# EAGLE design d701-vs1053-synth (EAGLE 7.5.0)
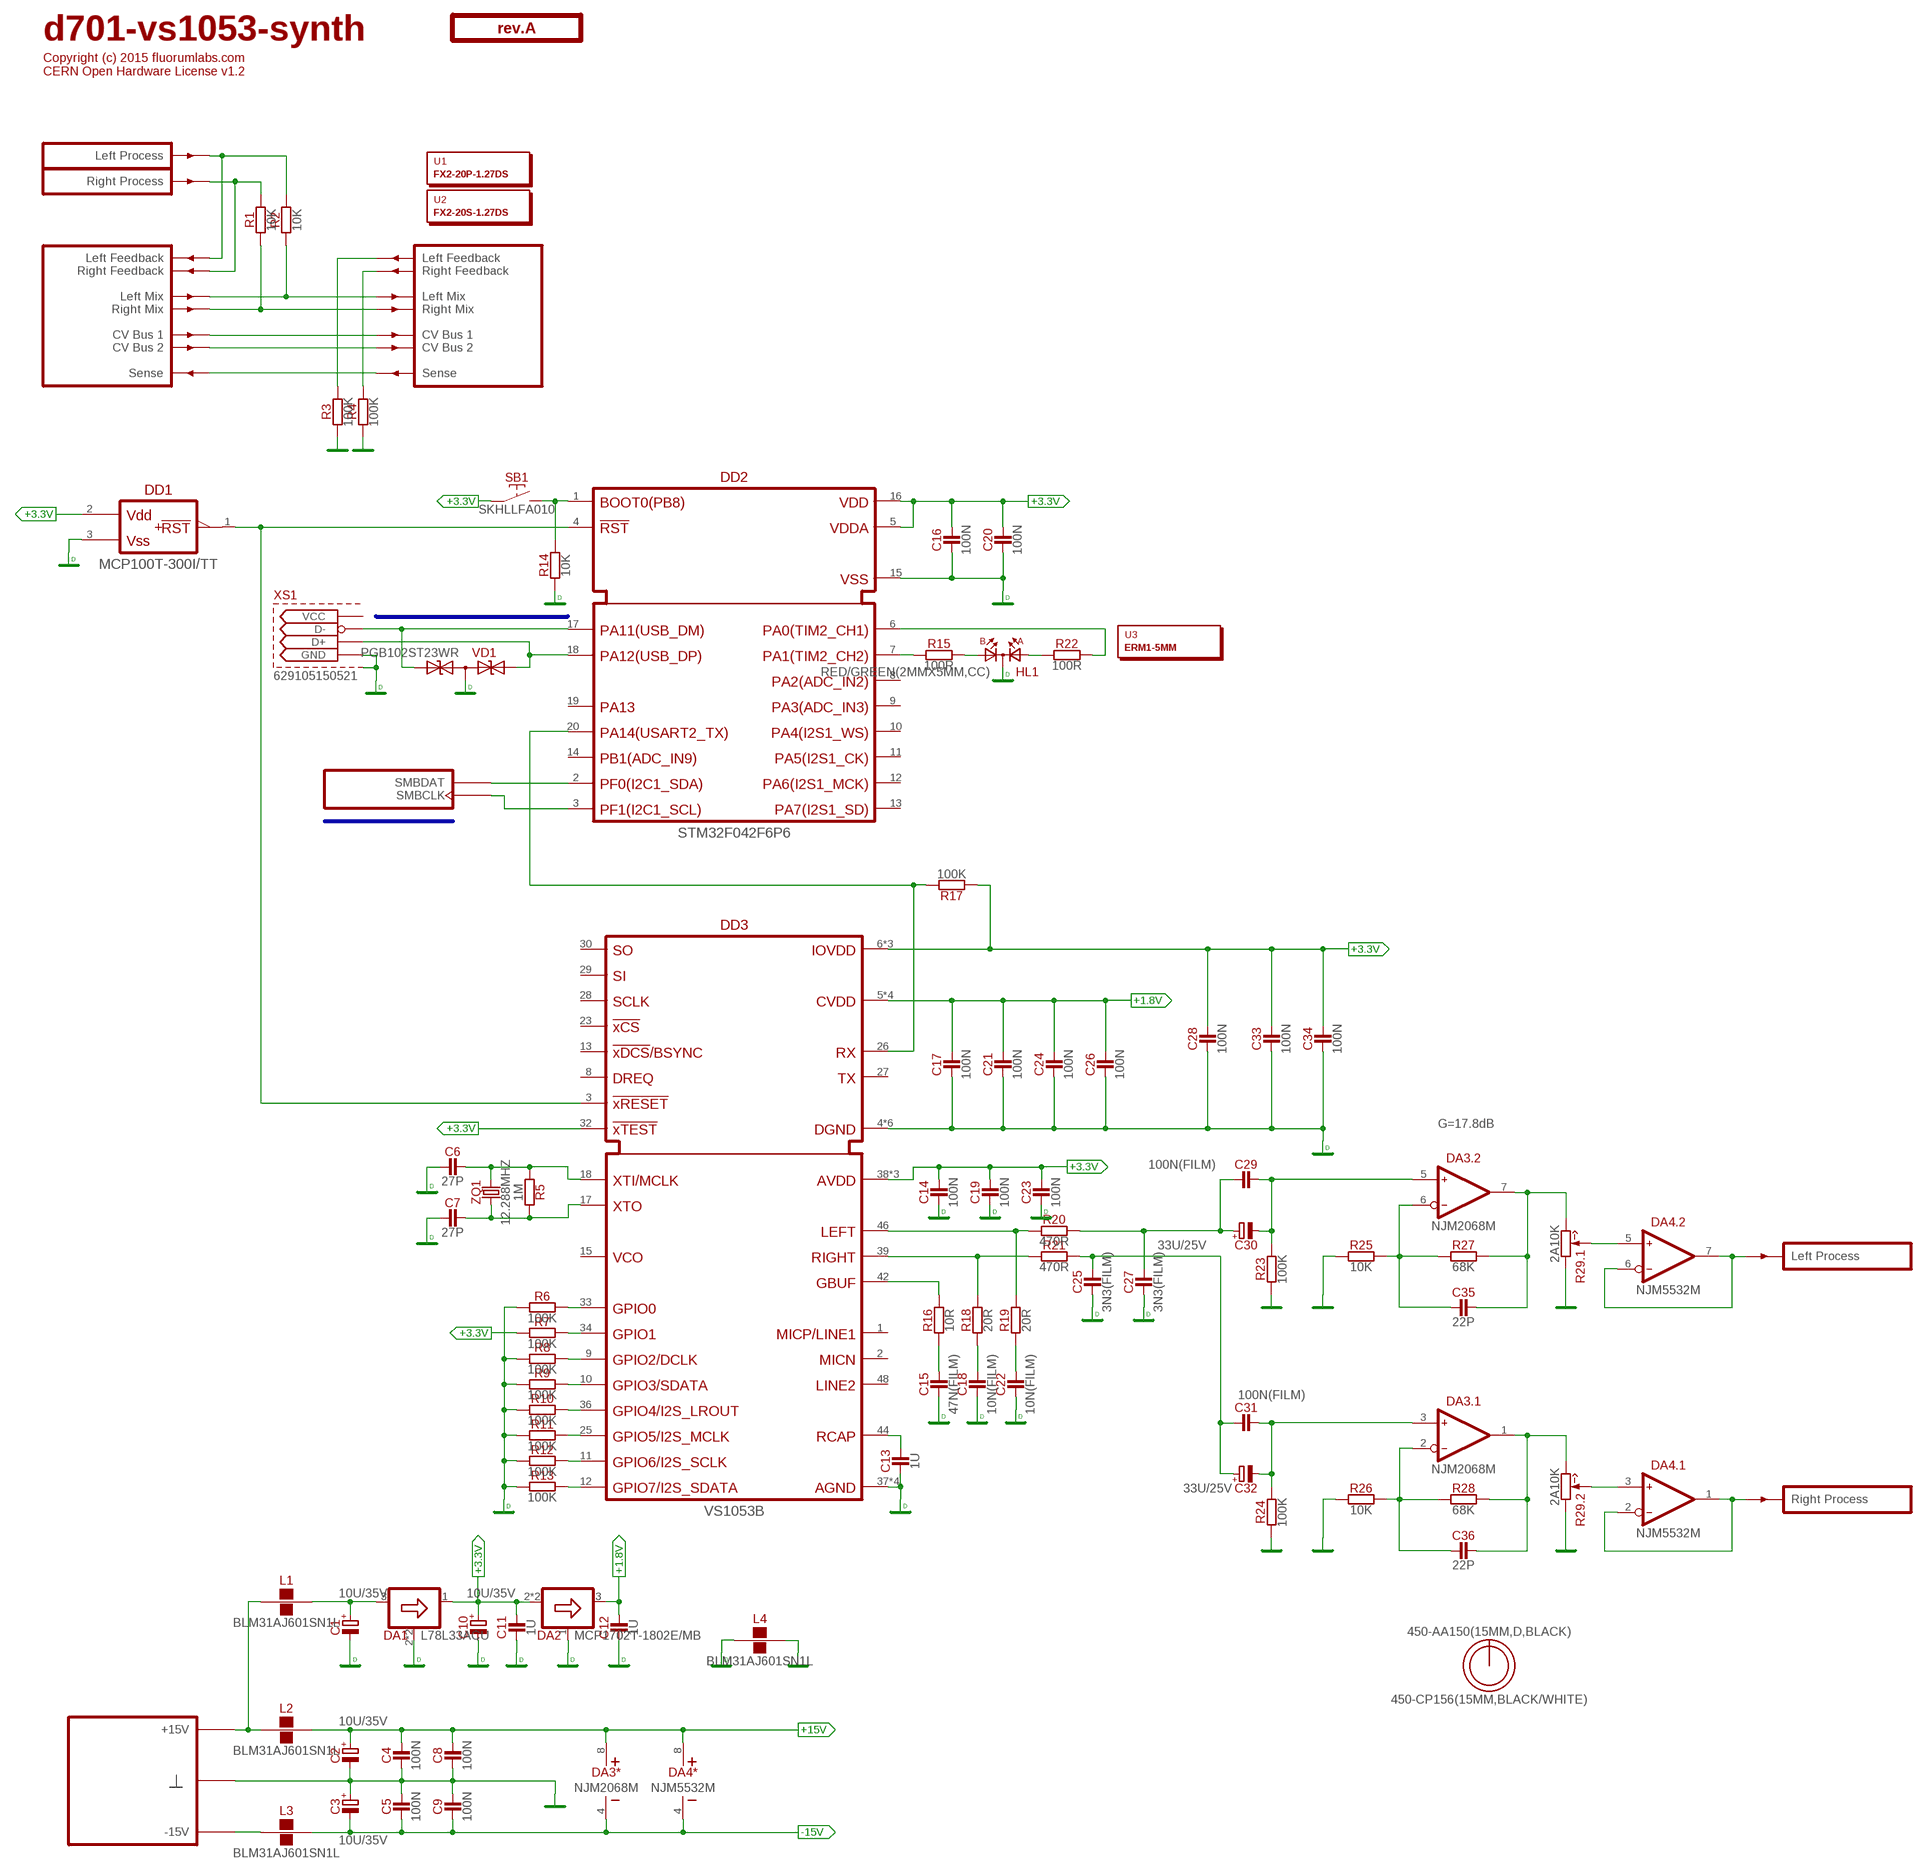
[diagram p0: schematic, sheet 1]

## Parts
C1  10U/35V  [E2-5]
C2  10U/35V  [E2-5]
C3  10U/35V  [E2-5]
C4  100N  [C-0805]
C5  100N  [C-0805]
C6  27P  [C-0805]
C7  27P  [C-0805]
C8  100N  [C-0805]
C9  100N  [C-0805]
C10  10U/35V  [E2-5]
C11  1U  [C-0805]
C12  1U  [C-0805]
C13  1U  [C-0805]
C14  100N  [C-0805]
C15  47N(FILM)  [C050-025X075]
C16  100N  [C-0805]
C17  100N  [C-0805]
C18  10N(FILM)  [C050-025X075]
C19  100N  [C-0805]
C20  100N  [C-0805]
C21  100N  [C-0805]
C22  10N(FILM)  [C050-025X075]
C23  100N  [C-0805]
C24  100N  [C-0805]
C25  3N3(FILM)  [C050-025X075]
C26  100N  [C-0805]
C27  3N3(FILM)  [C050-025X075]
C28  100N  [C-0805]
C29  100N(FILM)  [C050-025X075]
C30  33U/25V  [E2,5-7]
C31  100N(FILM)  [C050-025X075]
C32  33U/25V  [E2,5-7]
C33  100N  [C-0805]
C34  100N  [C-0805]
C35  22P  [C-0805]
C36  22P  [C-0805]
DA1  L78L33ACU  [SOT89]
DA2  MCP1702T-1802E/MB  [SOT89]
DA3  NJM2068M  [SO-8]
DA4  NJM5532M  [SO-8]
DD1  MCP100T-300I/TT  [SOT23]
DD2  STM32F042F6P6  [TSSOP20]
DD3  VS1053B  [LQFP48-7X7]
HL1  RED/GREEN(2MMX5MM,CC)  [LED2X5-3PIN]
L1  BLM31AJ601SN1L  [1206]
L2  BLM31AJ601SN1L  [1206]
L3  BLM31AJ601SN1L  [1206]
L4  BLM31AJ601SN1L  [1206]
O1  TITLE  [EMPTY]
O2  450-AA150(15MM,D,BLACK)  [EMPTY]
O3  450-CP156(15MM,BLACK/WHITE)  [EMPTY]
PCB1  rev.A  ST2-BOARD-50  [ST2-BOARD-50]
R1  10K  [R-0805]
R2  10K  [R-0805]
R3  100K  [R-0805]
R4  100K  [R-0805]
R5  1M  [R-0805]
R6  100K  [R-0805]
R7  100K  [R-0805]
R8  100K  [R-0805]
R9  100K  [R-0805]
R10  100K  [R-0805]
R11  100K  [R-0805]
R12  100K  [R-0805]
R13  100K  [R-0805]
R14  10K  [R-0805]
R15  100R  [R-0805]
R16  10R  [R-0805]
R17  100K  [R-0805]
R18  20R  [R-0805]
R19  20R  [R-0805]
R20  470R  [R-0805]
R21  470R  [R-0805]
R22  100R  [R-0805]
R23  100K  [R-0805]
R24  100K  [R-0805]
R25  10K  [R-0805]
R26  10K  [R-0805]
R27  68K  [R-0805]
R28  68K  [R-0805]
R29  2A10K  [RV11-DUAL]
SB1  SKHLLFA010  [SKHLLFA010]
U1  FX2-20P-1.27DS  [EMPTY]
U2  FX2-20S-1.27DS  [EMPTY]
U3  ERM1-5MM  [EMPTY]
VD1  PGB102ST23WR  [SOT23]
XS1  629105150521  [MICROUSB-WURTH]
ZQ1  12.288MHZ  [3225]

## Nets
+1.8V: C12.2 C17.2 C21.2 C24.2 C26.2 DA2.3(OUT) DD3.5(CVDD) DD3.7(CVDD) DD3.24(CVDD) DD3.31(CVDD)
+3.3V: C10.+ C11.2 C14.2 C16.2 C19.2 C20.2 C23.2 C28.2 C33.2 C34.2 DA1.1(OUT) DA2.2(IN) DA2.2@1(IN) DD1.2(VDD) DD2.5(VDDA) DD2.16(VDD) DD3.6(IOVDD) DD3.14(IOVDD) DD3.19(IOVDD) DD3.32(!XTEST) DD3.38(AVDD) DD3.43(AVDD) DD3.45(AVDD) R7.1 R17.1 SB1.1
+15V: C2.+ C4.2 C8.2 DA3.8(*:V+) DA4.8(*:V+) L2.2
-15V: C3.- C5.1 C9.1 DA3.4(*:V-) DA4.4(*:V-) L3.2
DGND: C1.- C6.1 C7.1 C10.- C11.1 C12.1 C13.1 C14.1 C15.1 C16.1 C17.1 C18.1 C19.1 C20.1 C21.1 C22.1 C23.1 C24.1 C25.1 C26.1 C27.1 C28.1 C33.1 C34.1 DA1.2(GND) DA1.2@1(GND) DA2.1(GND) DD1.3(VSS) DD2.15(VSS) DD3.4(DGND) DD3.16(DGND) DD3.20(DGND) DD3.21(DGND) DD3.22(DGND) DD3.35(DGND) DD3.37(AGND) DD3.40(AGND) DD3.41(AGND) DD3.47(AGND) HL1.K L4.1 R6.1 R8.1 R9.1 R10.1 R11.1 R12.1 R13.1 R14.1 VD1.3(C) XS1.5(GND) XS1.S1 XS1.S2(S1) XS1.S3(S1) XS1.S4(S1) XS1.S5(S1) XS1.S6(S1)
GND: C2.- C3.+ C4.1 C5.2 C8.1 C9.2 L4.2 PCB1.B4'(GND) PCB1.B4(GND) PCB1.B5'(GND) PCB1.B5(GND) PCB1.B6'(GND) PCB1.B6(GND) PCB1.B7'(GND) PCB1.B7(GND) PCB1.B8'(GND) PCB1.B8(GND) R3.1 R4.1 R23.1 R24.1 R25.1 R26.1 R29.1'(.2:CCW) R29.1(.1:CCW)
LMIX: PCB1.ALMIX'(LMIX') PCB1.ALMIX(LMIX) R2.1
N$1 [power]: L1.1 L2.1 PCB1.A+15'(P+15V) PCB1.A+15(P+15V) PCB1.B+15'(P+15V) PCB1.B+15(P+15V)
N$2: PCB1.ARFBK'(RFBK') R4.2
N$4: PCB1.ALFBK'(LFBK') R3.2
N$5 [power]: L3.1 PCB1.A-15'(P-15V) PCB1.A-15(P-15V) PCB1.B-15'(P-15V) PCB1.B-15(P-15V)
N$7: C27.2 C29.1 C30.+ R20.2
N$9: C31.2 C32.- DA3.3(.1:IN+) R24.2
N$10: C29.2 C30.- DA3.5(.2:IN+) R23.2
N$11: C36.2 DA3.1(.1:OUT) R28.2 R29.3'(.2:CW)
N$12: C35.2 DA3.7(.2:OUT) R27.2 R29.3(.1:CW)
N$13: C35.1 DA3.6(.2:IN-) R25.2 R27.1
N$14: C36.1 DA3.2(.1:IN-) R26.2 R28.1
N$16: PCB1.BSENSE'(SENSE') PCB1.BSENSE(SENSE)
N$17: C7.2 DD3.17(XTO) R5.2 ZQ1.1
N$18: DA4.6(.2:IN-) DA4.7(.2:OUT) PCB1.BOUTL'(OUTL)
N$21: DA4.1(.1:OUT) DA4.2(.1:IN-) PCB1.BOUTR'(OUTR)
N$23: DA4.5(.2:IN+) R29.2(.1:W)
N$25: DA4.3(.1:IN+) R29.2'(.2:W)
N$29: C1.+ DA1.3(IN) L1.2
N$31: C6.2 DD3.18(XTI/MCLK) R5.1 ZQ1.3
N$36: C25.2 C31.1 C32.+ R21.2
N$39: PCB1.ARFBK(RFBK) PCB1.BINR(INR) R1.2
N$40: PCB1.ALFBK(LFBK) PCB1.BINL(INL) R2.2
N$41: PCB1.ACV1'(CV1') PCB1.ACV1(CV1)
N$42: PCB1.ACV2'(CV2') PCB1.ACV2(CV2)
N$44: DD1.1(!RST) DD2.4(!RST) DD3.3(!XRESET)
N$45: DD3.12(GPIO7/I2S_SDATA) R13.2
N$46: DD3.11(GPIO6/I2S_SCLK) R12.2
N$47: DD3.25(GPIO5/I2S_MCLK) R11.2
N$48: DD2.20(PA14) DD3.26(RX) R17.2
N$49: DD3.36(GPIO4/I2S_LROUT) R10.2
N$50: DD3.10(GPIO3/SDATA) R9.2
N$51: DD3.9(GPIO2/DCLK) R8.2
N$52: DD3.34(GPIO1) R7.2
N$53: DD3.33(GPIO0) R6.2
N$54: C13.2 DD3.44(RCAP)
N$55: DD2.7(PA1) R15.1
N$56: C15.2 R16.1
N$57: HL1.A2 R15.2
N$58: DD3.42(GBUF) R16.2
N$59: DD3.39(RIGHT) R18.2 R21.1
N$60: C18.2 R18.1
N$61: DD3.46(LEFT) R19.2 R20.1
N$62: C22.2 R19.1
N$65: HL1.A1 R22.1
N$66: DD2.6(PA0) R22.2
N$67: DD2.1(BOOT0) R14.2 SB1.2
RMIX: PCB1.ARMIX'(RMIX') PCB1.ARMIX(RMIX) R1.1
SMBCLK: DD2.3(PF1) PCB1.ASMBCLK'(SMBCLK) PCB1.ASMBCLK(SMBCLK)
SMBDAT: DD2.2(PF0) PCB1.ASMBDAT'(SMBDAT) PCB1.ASMBDAT(SMBDAT)
USB_N: DD2.17(PA11) VD1.2(A1) XS1.2(D-)
USB_P: DD2.18(PA12) VD1.1(A) XS1.3(D+)
Unconnected: DD2.8(PA2) DD2.9(PA3) DD2.10(PA4) DD2.11(PA5) DD2.12(PA6) DD2.13(PA7) DD2.14(PB1) DD2.19(PA13) DD3.1(MICP/LINE1) DD3.2(MICN) DD3.8(DREQ) DD3.13(!XDCS/BSYNC) DD3.15(VCO) DD3.23(!XCS) DD3.27(TX) DD3.28(SCLK) DD3.29(SI) DD3.30(SO) DD3.48(LINE2) XS1.1(VCC)

## Buses
SMBDAT,SMBCLK
USB_N,USB_P

## Notes on the sheet
- G=17.8dB

## Library data of the parts
C1-C3 C10 = capacitors-electrolytic:?; MOUSER: 647-USW1V100MDD
C4 C5 C8 C9 C14 C16 C17 C19-C21 C23 C24 C26 C28 C33 C34 = capacitors:?; MOUSER: 77-VJ0805V104MXBPBC
C6 C7 = capacitors:?; MOUSER: 77-VJ0805A270GXACBC
C11-C13 = capacitors:?; MOUSER: 77-VJ0805V105ZXXTBC
C15 = capacitors:?; MOUSER: 871-B32529C1473J
C18 C22 = capacitors:?; MOUSER: 80-F622JF103J100C
C25 C27 = capacitors:?; MOUSER: 505-FKS23300/100/10
C29 C31 = capacitors:?; MOUSER: 505-MKS2.1/63/5
C30 C32 = capacitors-electrolytic:?
C35 C36 = capacitors:?; MOUSER: 77-VJ0805A220GXACBC
DA1 = regulators-linear:?; MOUSER: 511-L78L33ACU
DA2 = regulators-linear:?; MOUSER: 579-MCP1702T1802E/MB
DA3 = ic-jrc:NJM2068; MOUSER: 513-NJM2068M
DA4 = ic-jrc:NJM5532; MOUSER: 513-NJM5532M
DD1 = ic-microchip:MCP100; MOUSER: 579-MCP100T-300I/TT
DD2 = ic-stm:STM32F042F6P6; MOUSER: 511-STM32F042F6P6
DD3 = ic-vlsi:VS1053B
HL1 = optoelectronics:?(2MMX5MM,CC)
L1-L4 = inductors:BLM31AJ601SN1L; MOUSER: 81-BLM31AJ601SN1L
O1 = text:TITLE
O2 = hardware:450-AA?; MOUSER: 450-AA150
O3 = hardware:450-C?; MOUSER: 450-CP156
PCB1 = module-footprints:ST2-BOARD-?
R1 R2 R14 R25 R26 = resistors:?; MOUSER: 660-RK73H2ATTD1002F
R3 R4 R6-R13 R17 R23 R24 = resistors:?; MOUSER: 660-RK73H2ATTD1003F
R5 = resistors:?; MOUSER: 660-RK73H2ATTD1004F
R15 R22 = resistors:?; MOUSER: 660-RK73H2ATTD1000F
R16 = resistors:?; MOUSER: 660-RK73H2ATTD10R0F
R18 R19 = resistors:?; MOUSER: 660-RK73H2ATTD20R0F
R20 R21 = resistors:?; MOUSER: 660-RK73H2ATTD4700F
R27 R28 = resistors:?; MOUSER: 660-RK73H2ATTD6802F
R29 = potentiometers:2**?; MOUSER: 688-RK12L12C0A0E
SB1 = switches:SKHLLFA010; MOUSER: 688-SKHLLF
U1 = hardware:?; MOUSER: 798-FX2-20P-1.27DS71
U2 = hardware:?; MOUSER: 798-FX2-20S-1.27DS71
U3 = hardware:?
VD1 = diodes-zener:PGB102ST23WR; MOUSER: 576-PGB102ST23WR
XS1 = connectors:629105150521; MOUSER: 710-629105150521
ZQ1 = frequency:?; MOUSER: 581-CX3225GB1228PHPC

## Net classes
0 default: width 0.254 mm, drill 0.4 mm
1 power: width 0.406 mm, drill 0.4 mm

## Board
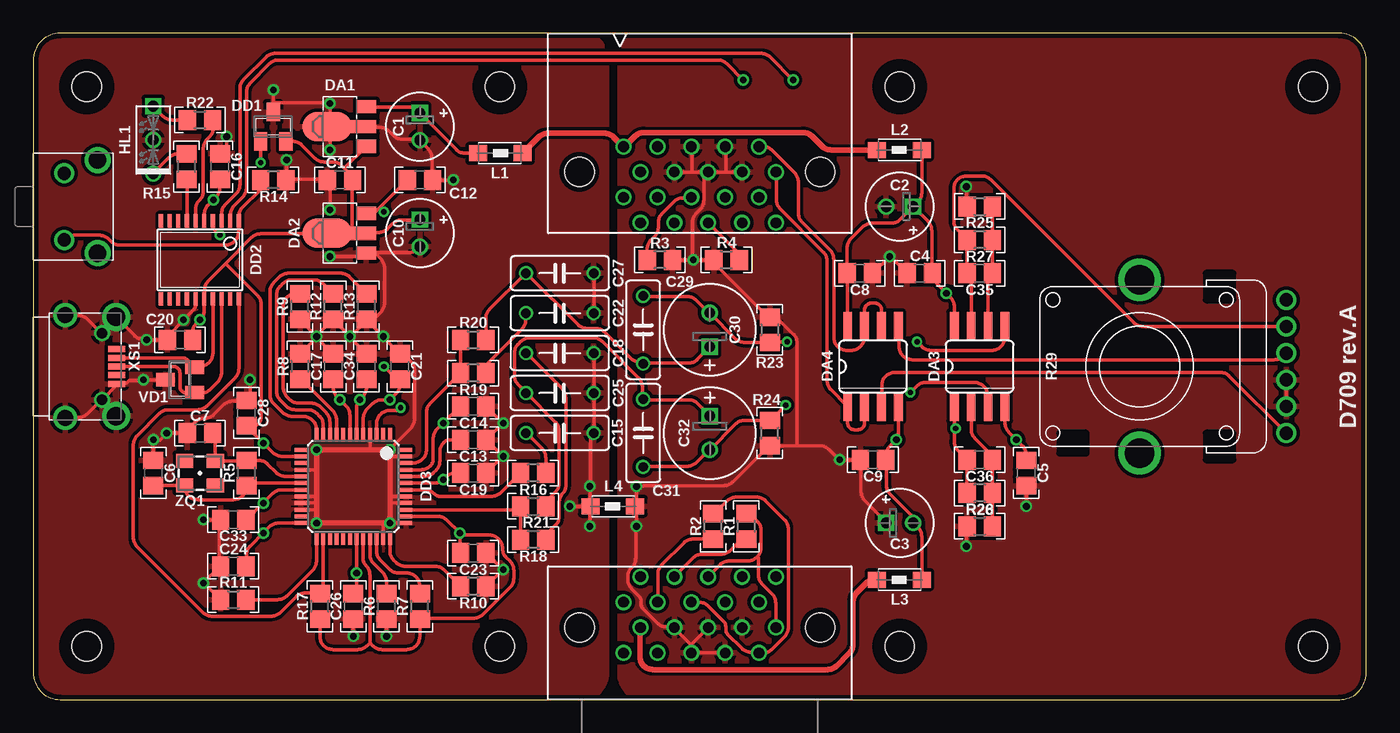
[diagram p1: board, top side]
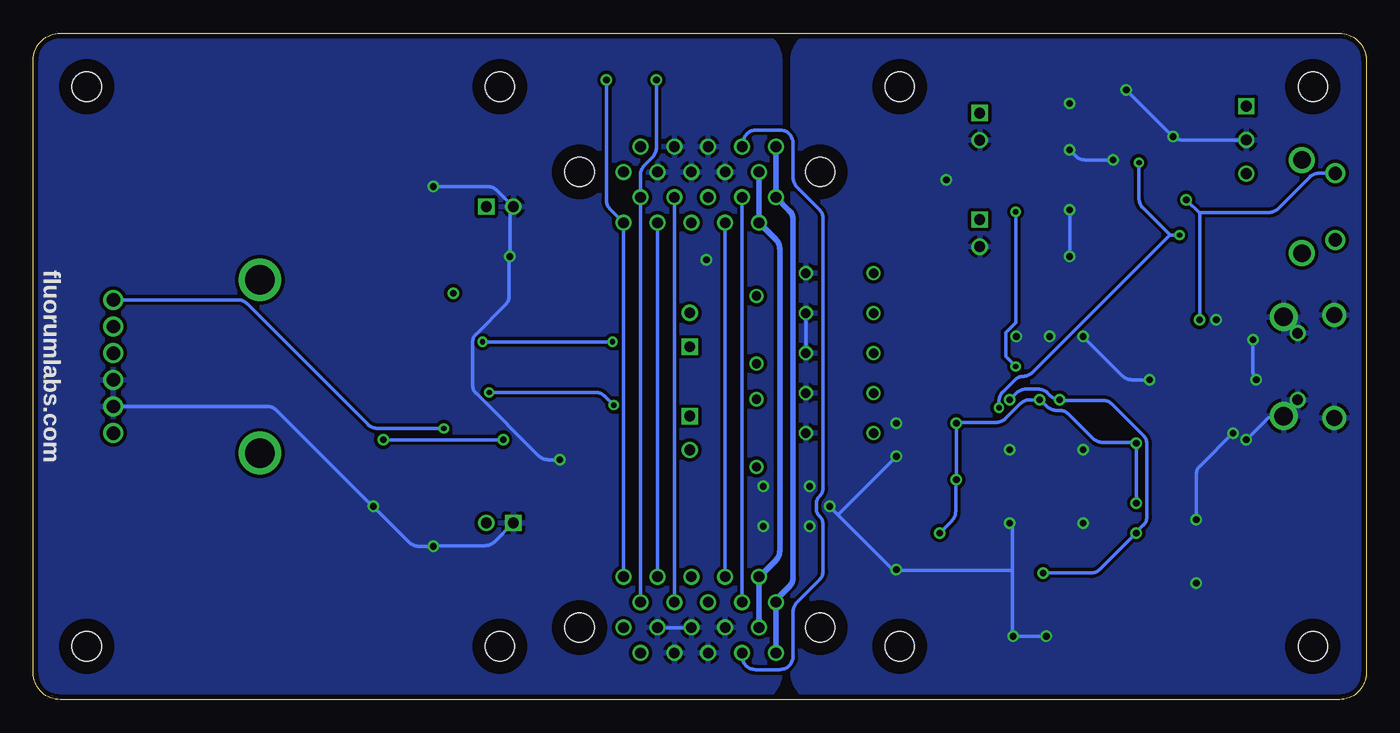
[diagram p2: board, bottom side, seen from below]

Size 100 x 50 mm. Coordinates in mm from the lower left corner, seen from the top.
Outline: 0,48 0,2 arc90 2,0 98,0 arc90 100,2 100,48 arc90 98,50 2,50 arc90 0,48
Copper layers (1*16): Top 0.0356mm / dielectric 1.5011mm / Bottom 0.0356mm
Design rules "sonictrain": minimum track width 6mil, minimum drill 13mil, track to track 8mil, track to pad 8mil, pad to pad 6mil, via to via 6mil, smd to smd 6mil, copper to edge 15mil, drill to drill 6mil, minimum pad ring 7mil, minimum via ring 7mil, stop-mask expansion 3mil, vias tented up to drill 25mil, thermal gap 10mil

### Footprints (pad centres in the part's own frame; a part is rotated, then mirrored left to right if it is on the bottom)
E2-5 = drill 0.813 square: + -1.016,0 | drill 0.813: - 1.016,0
C-0805 = smd 1.3 x 1.5: 1 -0.95,0; 2 0.95,0
C050-025X075 = drill 0.7: 1 -2.54,0; 2 2.54,0
E2,5-7 = drill 0.813 square: + -1.27,0 | drill 0.813: - 1.27,0
SOT89 = smd 1 x 1.5: 1 -1.499,-1.981; 3 1.499,-1.981 | smd 1 x 2: 2 0,-1.727 | smd 2.2 x 3.7: 2@1 0,0.94
SO-8 = smd 0.66 x 2.032: 1 -1.905,-3.073; 2 -0.635,-3.073; 3 0.635,-3.073; 4 1.905,-3.073; 5 1.905,3.073; 6 0.635,3.073; 7 -0.635,3.073; 8 -1.905,3.073
SOT23 = smd 1 x 1.4: 1 -0.95,-1.1; 2 0.95,-1.1; 3 0,1.1
TSSOP20 = smd 0.305 x 0.991: 1 -2.925,-2.918; 2 -2.275,-2.918; 3 -1.625,-2.918; 4 -0.975,-2.918; 5 -0.325,-2.918; 6 0.325,-2.918; 7 0.975,-2.918; 8 1.625,-2.918; 9 2.275,-2.918; 10 2.925,-2.918; 11 2.925,2.918; 12 2.275,2.918; 13 1.625,2.918; 14 0.975,2.918; 15 0.325,2.918; 16 -0.325,2.918; 17 -0.975,2.918; 18 -1.625,2.918; 19 -2.275,2.918; 20 -2.925,2.918
LQFP48-7X7 = smd 0.9 x 0.3: 1 -3.95,2.75; 2 -3.95,2.25; 3 -3.95,1.75; 4 -3.95,1.25; 5 -3.95,0.75; 6 -3.95,0.25; 7 -3.95,-0.25; 8 -3.95,-0.75; 9 -3.95,-1.25; 10 -3.95,-1.75; 11 -3.95,-2.25; 12 -3.95,-2.75; 25 3.95,-2.75; 26 3.95,-2.25; 27 3.95,-1.75; 28 3.95,-1.25; 29 3.95,-0.75; 30 3.95,-0.25; 31 3.95,0.25; 32 3.95,0.75; 33 3.95,1.25; 34 3.95,1.75; 35 3.95,2.25; 36 3.95,2.75 | smd 0.3 x 0.9: 13 -2.75,-3.95; 14 -2.25,-3.95; 15 -1.75,-3.95; 16 -1.25,-3.95; 17 -0.75,-3.95; 18 -0.25,-3.95; 19 0.25,-3.95; 20 0.75,-3.95; 21 1.25,-3.95; 22 1.75,-3.95; 23 2.25,-3.95; 24 2.75,-3.95; 37 2.75,3.95; 38 2.25,3.95; 39 1.75,3.95; 40 1.25,3.95; 41 0.75,3.95; 42 0.25,3.95; 43 -0.25,3.95; 44 -0.75,3.95; 45 -1.25,3.95; 46 -1.75,3.95; 47 -2.25,3.95; 48 -2.75,3.95
LED2X5-3PIN = drill 0.813 square: A1 -2.54,0 | drill 0.813: A2 2.54,0; K 0,0
1206 = smd 1.35 x 1.2: 1 -1.7,0; 2 1.65,0
ST2-BOARD-50 = drill 0.8: A+15 44.285,7.31; A+15' 44.285,37.69; A-15 45.555,9.215; A-15' 45.555,35.785; ACV1 51.905,7.31; ACV1' 51.905,37.69; ACV2 53.175,9.215; ACV2' 53.175,35.785; ALFBK 49.365,7.31; ALFBK' 49.365,37.69; ALMIX 46.825,7.31; ALMIX' 46.825,37.69; ARFBK 50.635,9.215; ARFBK' 50.635,35.785; ARMIX 48.095,9.215; ARMIX' 48.095,35.785; ASMBCLK 55.715,9.215; ASMBCLK' 55.715,35.785; ASMBDAT 54.445,7.31; ASMBDAT' 54.445,37.69; B4 48.095,5.405; B4' 48.095,39.595; B5 49.365,3.5; B5' 49.365,41.5; B6 50.635,5.405; B6' 50.635,39.595; B7 51.905,3.5; B7' 51.905,41.5; B8 53.175,5.405; B8' 53.175,39.595; B+15 44.285,3.5; B+15' 44.285,41.5; B-15 45.555,5.405; B-15' 45.555,39.595; BINL 54.445,3.5; BINR 55.715,5.405; BOUTL' 54.445,41.5; BOUTR' 55.715,39.595; BSENSE 46.825,3.5; BSENSE' 46.825,41.5 | hole 2.2: 4,4; 4,46; 96,4; 96,46; 35,46; 65,46; 65,4; 35,4; 59.025,5.405; 40.975,5.405; 40.975,39.595; 59.025,39.595
R-0805 = smd 1.3 x 1.5: 1 -0.95,0; 2 0.95,0
RV11-DUAL = drill 1: 1 -1,-11; 1' -3,-11; 2 1,-11; 2' -5,-11; 3 3,-11; 3' 5,-11 | drill 2.2: S1 -6.5,0; S2 6.5,0
SKHLLFA010 = drill 1: 1 -2.5,2.32; 2 2.5,2.32 | drill 1.3: S1 -3.5,4.82; S2 3.5,4.82
MICROUSB-WURTH = smd 0.45 x 1.3: 1 -1.3,6.25; 2 -0.65,6.25; 3 0,6.25; 4 0.65,6.25; 5 1.3,6.25 | drill 1.2: S1 -3.875,2.4; S4 3.875,2.4 | drill 1.4: S2 -3.725,6.2; S3 3.725,6.2 | drill 0.8: S5 -2.5,5.15; S6 2.5,5.15
3225 = smd 1.3 x 1.05: 1 -1.15,-0.925; 2 1.15,-0.925; 3 1.15,0.925; 4 -1.15,0.925

### Placement (x,y rotation side)
C1  29,43 270 top
C2  65,37 180 top
C3  65,13.25 0 top
C4  66.5,32 0 top
C5  74.5,17 270 top
C6  9,17 270 top
C7  12.5,20 0 top
C8  62,32 180 top
C9  63,18 180 top
C10  29,35 270 top
C11  23,39 0 top
C12  29,39 180 top
C13  33,19.5 180 top
C14  33,22 180 top
C15  39.5,20 180 top
C16  14,40 270 top
C17  22.5,25 270 top
C18  39.5,26 180 top
C19  33,17 180 top
C20  11,27 0 top
C21  27.5,25 270 top
C22  39.5,29 180 top
C23  33,11 180 top
C24  15,10 0 top
C25  39.5,23 180 top
C26  24,7 90 top
C27  39.5,32 180 top
C28  16,21.5 270 top
C29  45.75,27.75 90 top
C30  50.75,27.75 90 top
C31  45.75,20 270 top
C32  50.75,20 270 top
C33  15,13.5 0 top
C34  25,25 270 top
C35  71,32 180 top
C36  71,18 180 top
DA1  23,43 90 top
DA2  23,35 90 top
DA3  71,25 0 top
DA4  63,25 0 top
DD1  18,43 0 top
DD2  12.5,33 180 top
DD3  24,16 270 top
HL1  9,42 270 top
L1  35,41 180 top
L2  65,41.25 0 top
L3  65,9 0 top
L4  43.5,14.5 0 top
O2  84,-100 0 top  (outside the outline)
O3  87,-100 0 top  (outside the outline)
PCB1  D709 rev.A  [ST2-BOARD-50]  0,0 0 top
R1  53.5,13 90 top
R2  51,13 90 top
R3  47,33 180 top
R4  52,33 0 top
R5  16,17 90 top
R6  26.5,7 90 top
R7  29,7 90 top
R8  20,25 270 top
R9  20,29.5 90 top
R10  33,8.5 180 top
R11  15,7.5 0 top
R12  22.5,29.5 90 top
R13  25,29.5 90 top
R14  18,39 180 top
R15  11.5,40 90 top
R16  37.5,17 180 top
R17  21.5,7 90 top
R18  37.5,12 180 top
R19  33,24.5 180 top
R20  33,27 0 top
R21  37.5,14.5 0 top
R22  12.5,43.5 0 top
R23  55.25,27.75 270 top
R24  55.25,20 90 top
R25  71,37 0 top
R26  71,13 0 top
R27  71,34.5 180 top
R28  71,15.5 180 top
R29  2*A10K  [RV11-DUAL]  83,25 90 top
SB1  0,37 270 top
U1  96,-100 0 top  (outside the outline)
U2  2,-103 0 top  (outside the outline)
U3  5,-103 0 top  (outside the outline)
U4  SCREW-M2X8  [EMPTY]  -8,-104.25 0 top  (outside the outline)
U5  SCREW-M2X8  [EMPTY]  -9,-105.5 0 top  (outside the outline)
U6  SCREW-M2X8  [EMPTY]  -10,-106.75 0 top  (outside the outline)
U7  SCREW-M2X8  [EMPTY]  -11,-108 0 top  (outside the outline)
U8  NUT-M2-SELFLOCK  [EMPTY]  -12,-109.25 0 top  (outside the outline)
U9  NUT-M2-SELFLOCK  [EMPTY]  -13,-110.5 0 top  (outside the outline)
U10  NUT-M2-SELFLOCK  [EMPTY]  -14,-111.75 0 top  (outside the outline)
U11  NUT-M2-SELFLOCK  [EMPTY]  -15,-113 0 top  (outside the outline)
VD1  11,24 90 top
XS1  0,25 270 top
ZQ1  12.5,17 180 top

### Tracks (layer width: path | path; a pad name or v marks a point on that pad's centre or on a via)
+1.8V  (via drill 0.4, 0.5)
  Top 0.254: C24.2 16,10.05 16,10.84 arc-45 16.29,11.54 v17.25,12.5 17.71,12.96 arc-45 18.41,13.25 DD3.24 | C26.2 24.25,8.2 v24.25,9.5 DD3.31 | DD3.7 23.75,21.34 arc45 23.46,22.04 v23,22.5 22.79,22.71 arc-45 22.5,23.41 C17.2 | DD3.5 24.75,21.09 arc-45 25.04,21.79 25.46,22.21 arc-45 26.16,22.5 v26.75,22.5 27.21,22.96 arc45 27.5,23.66 C21.2 27.4,24.1 27.2,24.1 v26.3,25 | C12.2 25.98,36.92 | 25.98,36.92 25.55,36.5 25,36.5 DA2.3 | v26.3,36.6 25.98,36.92
  Bottom 0.254: v26.75,22.5 26.24,23.01 arc45 25.54,23.3 24.61,23.3 arc45 23.91,23.01 23.68,22.78 arc-45 v23,22.5 22.9,22.45 19.76,22.45 arc45 19.06,22.16 16.74,19.84 arc45 16.45,19.14 16.45,13.76 arc45 16.74,13.06 17.2,12.6 v17.25,12.5 19.96,9.79 arc45 20.66,9.5 v24.25,9.5 | v26.3,36.6 26.3,28.3 27.05,27.55 27.05,25.75 v26.3,25
+3.3V  (via drill 0.5)
  Top 0.254: DD3.38 30.34,13.75 arc-45 31.04,13.46 v32,12.5 | v32,12.5 32,11.05 C23.2 | DD3.45 29.09,17.25 arc45 29.79,17.54 arc45 30,18.04 30,19.59 arc-45 30.29,20.29 v30.75,20.75 32,22 C14.2 | DD3.32 24.75,10.54 arc45 24.96,10.04 arc-45 25.25,9.34 25.25,4.25 | 25.25,4.25 25.04,4.04 arc-45 24.34,3.75 22.5,3.75 arc-90 21.5,4.75 R17.1 | DD3.6 24.25,21.9 arc-45 v24.5,22.5 24.71,22.71 arc45 25,23.41 C34.2 | DD3.43 30.15,16.25 arc45 v30.75,16.5 30.96,16.71 arc-45 31.66,17 C19.2 | DD3.14 18.66,18.25 arc-45 17.96,18.54 v17.25,19.25 16,20.5 C28.2 arc117 17.1,21.23 17.1,29.64 arc45 16.81,30.34 14.43,32.73 | DD3.19 18.66,15.75 arc45 17.96,15.46 v17.25,14.75 16,13.5 C33.2 | DD2.5 12.82,36.41 arc-45 13.12,37.12 v13.5,37.5 13.71,37.71 arc45 14,38.41 C16.2 | C20.2 11.95,27.54 arc-45 12.24,28.24 v12.5,28.5 12.53,28.53 arc45 12.82,29.24 DD2.16 12.85,30.2 12.85,30.74 arc-45 13.14,31.44 14.43,32.73 | 25.25,4.25 25.46,4.04 arc45 26.16,3.75 28,3.75 arc90 29,4.75 R7.1 29.1,6.1 33.04,6.1 arc45 33.74,6.39 35.76,8.41 arc45 36.05,9.11 36.05,9.69 arc45 35.76,10.39 35.48,10.67 arc-45 35.2,11.35 arc90 34.2,12.35 32.1,12.35 v32,12.5 | 23.32,39.88 23.14,40.06 arc45 22.44,40.35 21.81,40.35 arc-45 21.11,40.64 20.14,41.61 arc45 19.44,41.9 DD1.2 | 23.32,39.88 23.95,39.25 C11.2 23.9,38.9 23.9,35.1 DA2.2 | 23.32,39.88 24.95,41.5 DA1.1 | DA2.2 DA2.2@1 21.95,34.95 17.06,34.95 arc45 16.36,34.66 14.43,32.73 | C10.+ 29,36 27.66,36 arc45 26.96,35.71 26.59,35.34 arc-45 25.89,35.05 24.85,35.05 DA2.2
  Bottom 0.254: v17.25,14.75 v17.25,19.25 17.35,19.3 19.79,19.3 arc45 20.49,19.59 22.31,21.41 arc-45 23.01,21.7 23.24,21.7 arc45 23.94,21.99 24.4,22.45 v24.5,22.5 25.24,22.5 arc-45 25.94,22.21 27.06,21.09 arc45 27.76,20.8 30.65,20.8 v30.75,20.75 v30.75,16.5 30.8,16.4 30.8,14.11 arc45 31.09,13.41 v32,12.5 | 12.5,36.5 v12.5,28.5 | v13.5,37.5 12.5,36.5 | 12.5,36.5 arc27 12.29,36.55 7.31,36.55 arc-45 6.61,36.84 4.24,39.21 arc45 3.54,39.5 SB1.1
+15V  (via drill 0.5)
  Top 0.254: DA3.8 69.09,29.49 arc45 68.8,30.2 v68.5,30.5 67.45,31.55 C4.2 67.4,32.1 67.4,35.19 arc45 67.11,35.89 66.1,36.9 C2.+ | L2.2 66.65,38.01 arc-45 66.36,37.31 66.05,37 C2.+ | DA4.8 61.09,31.95 C8.2 61.05,33.89 arc-45 61.34,34.59 62.21,35.46 arc-45 62.91,35.75 64.35,35.75 arc45 65.06,36.04 C2.+
-15V  (via drill 0.5)
  Top 0.254: DA4.4 64.91,19.87 arc-45 v64.75,19.5 64.24,18.99 arc45 63.95,18.29 C9.1 64,17.9 64,16.11 arc45 64.29,15.41 65.95,13.75 65.95,13.35 C3.- 66.05,13.25 66.36,12.94 arc-45 66.65,12.24 L3.2 | DA3.4 72.91,20.76 arc45 73.2,20.05 v73.75,19.5 74.21,19.04 arc-45 74.5,18.34 C5.1
  Bottom 0.254: v64.75,19.5 v73.75,19.5
DGND  (via drill 0.5)
  Top 0.254: DD3.35 26.25,13.25 | DD3.37 v26.75,13.25 | DD3.41 26.75,15.25 | DD3.40 26.75,14.75 | DD3.47 26.75,18.25 | DD3.4 25.25,18.75 | DD3.16 21.25,17.25 | DD3.20 21.25,15.25 | DD3.21 21.25,14.75 | DD3.22 21.25,14.25 | DD2.15 12.18,29.63 arc-45 12.03,29.28 v11.25,28.5 11.2,28.4 10.1,27.3 10.1,27.1 C20.1 v8.5,27 8.4,27.05 8.26,27.05 arc-45 7.56,27.34 6.2,28.7 XS1.S2 6.2,28.55 XS1.S5 5.05,27.55 4.04,28.56 arc45 3.34,28.85 2.4,28.85 XS1.S1 | C26.1 v24,4.75 | R6.1 v26.5,4.75 | C19.1 35.15,18.2 v35.25,18.25 34,19.5 C13.1 34.05,19.55 v35.25,20.75 35.15,20.8 C14.1 | C22.1 C27.1 | C23.1 34,11 v35.25,9.75 35.15,9.7 R10.1 | L4.1 v40.25,14.5 | v41.75,13 41.75,14.4 L4.1 | L4.1 41.75,14.6 v41.75,16 41.8,16.1 41.8,19.52 arc-45 42,20 C15.1 42.05,20.1 C25.1 42.05,23.1 C18.1 | VD1.3 v8.25,24 8.15,23.95 7.2,23.95 7,23.75 6.35,23.75 XS1.5 6.25,23.6 XS1.S6 | XS1.S4 2.4,21.15 3.34,21.15 arc45 4.04,21.44 5.05,22.45 XS1.S6 | XS1.S3 6.2,21.4 5.2,22.4 XS1.S6 | v12.75,13.5 C33.1 13.95,13.4 13.95,10.1 C24.1 14,10 v12.75,8.75 12.85,8.7 R11.1 | v16.25,24 16.25,22.7 C28.1 15.9,22.4 14.96,22.4 arc45 14.26,22.11 13.54,21.39 arc-45 12.84,21.1 12.81,21.1 arc45 12.11,20.81 11.6,20.3 11.6,20.1 C7.1 v10,20 9.5,19.5 v9,19.5 C6.1 | R13.1 25,28.5 v26.25,27.25 26.3,27.15 C21.1 27.6,25.9 27.8,25.9 28.31,25.39 arc-45 28.6,24.69 28.6,21.06 arc-45 28.31,20.36 26.85,18.9 v26.75,18.75 | v21.25,27.25 20,28.5 R9.1 | R8.1 21.2,27.15 v21.25,27.25 | C17.1 21.3,27.15 v21.25,27.25 | v23.75,27.25 22.5,28.5 R12.1 21.3,27.35 v21.25,27.25 | C34.1 23.8,27.15 v23.75,27.25 | R13.1 24.95,28.4 23.85,27.3 v23.75,27.25 | v22.25,33.25 24.7,33.25 24.95,33.5 DA2.1
  Top 0.254: v19,40.5 19,39.05 R14.1 19.1,39.05 21.95,39.05 C11.1 22.25,38.8 v22.25,36.75 | C10.- 29,33.95 29.05,33.95 28.94,33.84 arc-45 28.24,33.55 25.1,33.55 DA2.1 | R13.1 25.45,28.45 26.06,29.06 arc45 26.35,29.76 26.35,32.39 arc45 26.06,33.09 25.7,33.45 DA2.1 | v14.5,42.25 14.5,41.45 C16.1 | DD1.3 18,44.8 | 18,44.8 v18,45.75 | v31.5,39 C12.1 29.9,39.1 29.9,40.64 arc45 29.61,41.34 29,41.95 C1.- 28.9,42.05 27.71,42.05 arc-45 27.01,42.34 26.69,42.66 arc45 25.99,42.95 24.85,42.95 DA1.2 22.45,43 22.35,42.9 DA1.2@1 | v22.25,41.25 22.25,42.85 22.1,43 DA1.2@1 | DA1.2@1 22.15,43.1 22.25,43.2 v22.25,44.75 22.15,44.8 18,44.8
  Top 0.406: v21.25,13.25 21.25,14.25 21.25,14.75 21.25,15.25 21.25,17.25 v21.25,18.75 25.25,18.75 v26.75,18.75 26.75,18.25 26.75,15.25 26.75,14.75 v26.75,13.25 26.25,13.25 v21.25,13.25
  Bottom 0.254: v24,4.75 v26.5,4.75 26.55,4.85 26.55,9.7 | 26.55,9.7 26.55,13.05 v26.75,13.25 | v40.25,14.5 39.62,13.88 | 39.62,13.88 35.5,9.75 v35.25,9.75 35.15,9.7 26.55,9.7 | C22.1 C18.1 | 39.62,13.88 v35.25,18.25 | v8.25,24 arc45 8.5,24.6 v8.5,27 | v10,20 12.46,17.54 arc-45 12.75,16.84 v12.75,13.5 | v9,19.5 7.54,20.96 arc45 6.84,21.25 6.2,21.25 XS1.S3 | v22.25,36.75 v22.25,33.25 | v18,45.75 v14.5,42.25 14.4,42.2 arc-45 13.92,42 HL1.K | v22.25,41.25 21.79,40.79 arc-45 21.09,40.5 v19,40.5 | v21.25,27.25 18.29,24.29 arc-45 17.59,24 v16.25,24
  pour Bottom (isolate 0.254, rank 2): 43,48 43,2 arc-90 41,0 2,0 arc-90 0,2 0,48 arc-90 2,50 41,50 arc-90
  pour Top (isolate 0.254, rank 2): 43,48 43,2 arc-90 41,0 2,0 arc-90 0,2 0,48 arc-90 2,50 41,50 arc-90
GND  (via drill 0.5)
  Top 0.254: R29.1 R29.1' | v70,11.5 70,12.95 R26.1 | C5.2 v74.5,14.5 | 49.4,39.6 50.6,39.6 PCB1.B6' | 49.4,39.6 PCB1.B4' | 51.95,39.6 50.75,39.6 PCB1.B6' | 51.95,39.6 53.15,39.6 PCB1.B8' | 49.4,39.6 49.4,41.5 PCB1.B5' | 51.95,39.6 51.95,41.5 PCB1.B7' | R3.1 v49.5,33 | v49.5,33 R4.1 51.05,32.75 55.1,28.7 R23.1 55.35,28.65 55.8,28.65 57.01,27.44 arc-45 57.3,26.74 57.3,19.05 | PCB1.B6' 50.3,39.5 50.3,37.46 arc-45 50.01,36.76 49.74,36.49 arc45 49.45,35.79 49.45,33.1 v49.5,33 | 49.35,4.1 49.35,3.5 PCB1.B5 PCB1.B7 | 49.35,4.1 48.15,5.3 PCB1.B4 48.05,5.45 47.51,5.45 arc-45 46.81,5.74 45.75,6.8 arc-45 45.6,7.16 45.6,7.39 arc45 45.45,7.75 44.89,8.31 arc-45 44.6,9.01 44.6,9.19 arc-45 44.89,9.89 44.91,9.91 arc45 45.2,10.61 45.2,12.9 v45.25,13 45.25,14.4 L4.2 45.25,14.55 v45.25,16 45.35,16.05 51.79,16.05 arc45 52.49,16.34 55.15,19 R24.1 57.3,19.05 | PCB1.B6 50.6,5.4 49.4,4.2 49.35,4.1 | C8.1 63,32 v64.25,33.25 64.35,33.2 C4.1 | v70,38.5 70,37.05 R25.1 | 57.3,19.05 58.99,19.05 arc-45 59.69,18.76 60.4,18.05 v60.5,18 C9.2 62.1,17.9 62.1,15.61 arc45 62.39,14.91 63.95,13.35 63.95,13.25 C3.+
  Bottom 0.254: R29.1' 82.46,22 arc45 81.76,21.71 74.6,14.55 v74.5,14.5 71.79,11.79 arc-45 71.09,11.5 v70,11.5 69.9,11.55 66.11,11.55 arc-45 65.41,11.84 64,13.25 C3.+ | PCB1.B8 53.15,5.4 50.65,5.4 PCB1.B6 | v70,38.5 65.91,38.5 arc45 65.21,38.21 64,37 C2.- 64.05,36.9 64.25,36.7 v64.25,33.25 64.3,33.15 64.3,30.31 arc45 64.59,29.61 66.76,27.44 arc-45 67.05,26.74 67.05,23.66 arc-45 66.76,22.96 62.09,18.29 arc-45 61.39,18 v60.5,18
  pour Bottom (isolate 0.254): 98,0 46,0 arc-90 44,2 44,48 arc-90 46,50 98,50 arc-90 100,48 100,2 arc-90
  pour Top (isolate 0.254): 98,0 46,0 arc-90 44,2 44,48 arc-90 46,50 98,50 arc-90 100,48 100,2 arc-90
LMIX
  Top 0.254: R2.1 49.51,12.05 arc45 48.81,11.76 47.14,10.09 arc45 46.85,9.39 46.85,7.35 PCB1.ALMIX
  Bottom 0.254: PCB1.ALMIX' PCB1.ALMIX
N$1
  Top 0.406: L2.1 59.86,41.25 arc-45 59.16,41.54 58.44,42.26 arc45 57.74,42.55 45.81,42.55 arc45 45.11,42.26 44.45,41.6 PCB1.B+15' 44.25,41.5 43.54,42.21 arc45 42.84,42.5 38.61,42.5 arc45 37.91,42.21 L1.1
  Bottom 0.406: PCB1.B+15 PCB1.A+15 44.28,7.46 43.29,8.46 arc-45 43,9.16 43,35.99 arc-45 43.29,36.7 PCB1.A+15' PCB1.B+15'
N$2
  Top 0.254: R4.2 52.95,33.45 50.65,35.75 PCB1.ARFBK'
N$4
  Top 0.254: R3.2 46.05,33.79 arc-45 46.34,34.49 46.61,34.76 arc45 46.9,35.46 46.9,35.79 arc-45 47.19,36.49 48.06,37.36 arc-45 48.76,37.65 49.35,37.65 PCB1.ALFBK'
N$5
  Top 0.406: L3.1 63.16,9 arc45 62.46,8.71 61.79,8.04 arc45 61.5,7.34 61.5,4.16 arc-45 61.21,3.46 60.29,2.54 arc-45 59.59,2.25 46.5,2.25 arc-90 45.5,3.25 45.5,5.35 PCB1.B-15
  Bottom 0.406: PCB1.B-15 PCB1.A-15 45.53,9.21 44.29,10.46 arc-45 44,11.16 44,33.82 arc-45 44.29,34.52 PCB1.A-15' PCB1.B-15'
N$7
  Top 0.254: C30.+ 50.75,26.45 49.84,25.54 arc-45 49.14,25.25 45.75,25.25 C29.1 45.65,25.3 45.56,25.3 arc-45 44.86,25.59 42.89,27.56 arc45 42.19,27.85 41.56,27.85 arc-45 40.86,28.14 37.05,31.95 C27.2 34.24,29.29 arc45 33.95,28.59 R20.2
N$9  (via drill 0.4)
  Top 0.254: v65.8,23.05 66.26,23.51 arc-45 66.96,23.8 70.6,23.8 arc-90 71.6,22.8 71.6,21.95 DA3.3 | v56.45,22.1 55.35,21 R24.2 53.36,20.95 arc45 52.66,20.66 50.75,18.75 C32.- 50.65,18.7 49.74,17.79 arc-45 49.04,17.5 45.75,17.5 C31.2
  Bottom 0.254: v56.45,22.1 57.11,22.76 arc-45 57.81,23.05 v65.8,23.05
N$10  (via drill 0.4)
  Top 0.254: v66.3,26.85 66.66,26.49 arc45 67.36,26.2 71.9,26.2 arc90 72.9,27.2 72.9,28.05 DA3.5 | v56.55,26.85 55.35,26.85 R23.2 53.36,26.8 arc-45 52.66,27.09 50.75,29 C30.- 50.65,29.05 49.74,29.96 arc45 49.04,30.25 45.75,30.25 C29.2
  Bottom 0.254: v56.55,26.85 v66.3,26.85
N$11  (via drill 0.4)
  Top 0.254: R28.2 C36.2 69.39,18.66 arc-45 69.09,19.37 69.09,20.35 | DA3.1 69.09,20.35 | v69.2,20.35 69.09,20.35
  Bottom 0.254: R29.3' 84.66,30 arc45 83.96,29.71 74.89,20.64 arc-45 74.19,20.35 v69.2,20.35
N$12
  Top 0.254: DA3.7 70.36,31.68 C35.2 R27.2 70,34.6 69.34,35.26 arc-45 69.05,35.96 69.05,38.3 arc-90 70.05,39.3 71.14,39.3 arc-45 71.84,39.01 82.56,28.29 arc45 83.26,28 R29.3
N$13
  Top 0.254: DA3.6 71.64,31.68 C35.1 R27.1 R25.2
N$14
  Top 0.254: DA3.2 70.36,20.3 arc45 70.66,19.59 71.95,18.3 C36.1 R28.1 R26.2
N$16
  Bottom 0.254: PCB1.BSENSE 46.83,3.25 arc-90 45.83,2.25 44,2.25 arc-90 43,3.25 43,6.59 arc45 42.71,7.29 41.04,8.96 arc-45 40.75,9.66 40.75,13.09 arc-45 41.04,13.79 arc45 41.25,14.29 41.25,14.71 arc45 41.04,15.21 arc-45 40.75,15.91 40.75,36.09 arc-45 41.04,36.79 42.71,38.46 arc45 43,39.16 43,41.75 arc-90 44,42.75 45.75,42.75 arc-90 46.75,41.75 46.75,41.58 PCB1.BSENSE'
N$17
  Top 0.254: DD3.17 18.91,16.75 arc-45 18.21,17.04 17.59,17.66 arc45 16.89,17.95 R5.2 15.97,17.93 ZQ1.1 13.65,19.8 C7.2
N$18
  Top 0.254: DA4.6 63.63,29.25 arc90 63.13,29.75 62.87,29.75 arc90 62.37,29.25 DA4.7 62.35,27.95 62.35,27.2 arc-90 61.35,26.2 61.05,26.2 arc-90 60.05,27.2 60.05,33.04 arc45 59.76,33.74 57.69,35.81 arc-45 57.4,36.51 57.4,38.84 arc45 57.11,39.54 55.44,41.21 arc45 54.74,41.5 PCB1.BOUTL'
N$21
  Top 0.254: DA4.2 62.37,20.75 arc-90 61.87,20.25 61.59,20.25 arc-90 61.09,20.75 DA4.1 61.05,22.05 59.84,23.26 arc-45 59.55,23.96 59.55,32.89 arc45 59.26,33.59 56.04,36.81 arc-45 55.75,37.51 55.75,39.55 PCB1.BOUTR'
N$23
  Top 0.254: R29.2 93.79,25.79 arc-45 93.09,25.5 65.95,25.5 arc-90 64.95,26.5 64.95,28.05 DA4.5
N$25
  Top 0.254: R29.2' 89.74,24.26 arc45 89.04,24.55 64.65,24.55 arc90 63.65,23.55 63.65,21.95 DA4.3
N$29
  Top 0.254: L1.2 32.41,41 arc-45 31.71,41.29 29,44 C1.+ 28.9,44.05 28.5,44.45 25,44.45 DA1.3
N$31
  Top 0.254: DD3.18 16.48,16.25 arc45 R5.1 16,16 arc-90 15,15 12.35,15 arc-90 11.35,16 ZQ1.3 9.03,16.07 C6.2
N$36
  Top 0.254: C32.+ 50.75,21.3 49.84,22.21 arc45 49.14,22.5 45.75,22.5 C31.1 45.7,22.65 45.7,23.44 arc45 45.41,24.14 42.69,26.86 arc45 41.99,27.15 37.26,27.15 arc45 36.56,26.86 36.39,26.69 arc45 36.1,25.99 36.1,24.31 arc45 36.39,23.61 36.9,23.1 C25.2 37,23 39.16,20.84 arc-45 39.45,20.14 39.45,16.26 arc-45 39.16,15.56 38.45,14.85 R21.2
N$39
  Top 0.254: R1.2 53.75,13.95 54.31,13.39 arc-45 54.6,12.69 54.6,11.39 arc-45 54.33,10.72 | 54.33,10.72 54.29,10.69 arc-45 53.59,10.4 52.21,10.4 arc45 51.51,10.11 50.65,9.25 PCB1.ARFBK | 54.33,10.72 54.4,10.65 54.4,9.36 arc45 54.69,8.66 55.41,7.94 arc-45 55.7,7.24 55.7,5.45 PCB1.BINR
N$40
  Top 0.254: R2.2 51.1,13.95 52.06,14.91 arc-45 52.76,15.2 54.24,15.2 arc-45 54.94,14.91 56.36,13.49 arc-45 56.65,12.79 56.65,5.41 arc-45 56.36,4.71 55.44,3.79 arc-45 54.74,3.5 PCB1.BINL 54.35,3.55 53.86,3.55 arc-45 53.16,3.84 52.1,4.9 arc-45 51.95,5.26 51.95,5.49 arc45 51.8,5.85 50.64,7.01 arc45 49.94,7.3 49.4,7.3 PCB1.ALFBK
N$41
  Bottom 0.254: PCB1.ACV1 PCB1.ACV1'
N$42
  Bottom 0.254: PCB1.ACV2' PCB1.ACV2
N$44  (via drill 0.4)
  Top 0.254: DD3.3 25.75,20.7 arc-90 26.75,21.7 27.35,21.7 v27.55,21.9 | v14,34.85 13.5,35.35 13.5,35.9 DD2.4 | v17.05,40.3 DD1.1
  Bottom 0.254: v27.55,21.9 27.55,22.39 arc45 27.26,23.09 26.34,24.01 arc45 25.76,24.25 arc-45 25.06,24.54 14.75,34.85 | v14,34.85 14.75,34.85 | v17.05,40.3 17.05,37.61 arc-45 16.76,36.91 14.8,34.95 14.75,34.85
N$45
  Top 0.254: DD3.12 21.25,20.25 arc90 20.25,21.25 19.41,21.25 arc-45 18.71,21.54 18.04,22.21 arc-45 17.75,22.91 17.75,30.59 arc-45 18.04,31.29 18.46,31.71 arc-45 19.16,32 23.04,32 arc-45 23.74,31.71 R13.2
N$46
  Top 0.254: DD3.11 21.75,20.59 arc45 21.46,21.29 21.29,21.46 arc45 20.59,21.75 19.66,21.75 arc-45 18.96,22.04 18.54,22.46 arc-45 18.25,23.16 18.25,30.34 arc-45 18.54,31.04 18.71,31.21 arc-45 19.41,31.5 21.04,31.5 arc-45 21.74,31.21 R12.2
N$47
  Top 0.254: DD3.25 21.25,10.41 arc-45 20.96,9.71 19.04,7.79 arc-45 18.34,7.5 R11.2
N$48
  Top 0.254: DD3.26 21.75,8.2 R17.2 21.45,8 20.41,8 arc45 19.71,7.71 18.54,6.54 arc-45 17.84,6.25 13.41,6.25 arc-45 12.71,6.54 7.79,11.46 arc-45 7.5,12.16 7.5,19.09 arc-45 7.79,19.79 9.46,21.46 arc-45 10.16,21.75 12.34,21.75 arc45 13.04,22.04 15.13,24.13 arc45 15.43,24.84 DD2.20
N$49
  Top 0.254: DD3.36 26.75,11.16 arc45 27.04,10.46 27.21,10.29 arc45 27.91,10 30.14,10 arc-45 30.84,9.71 R10.2
N$50
  Top 0.254: DD3.10 22.25,20.84 arc45 21.96,21.54 21.54,21.96 arc45 20.84,22.25 19.91,22.25 arc-45 19.21,22.54 19.04,22.71 arc-45 18.75,23.41 18.75,29.5 arc-90 19.75,30.5 19.95,30.5 R9.2
N$51
  Top 0.254: DD3.9 22.75,20.99 arc45 22.46,21.69 20.1,24.05 R8.2
N$52
  Top 0.254: DD3.34 25.75,11.16 arc45 26.04,10.46 26.71,9.79 arc45 27.41,9.5 28,9.5 arc-90 29,8.5 R7.2
N$53
  Top 0.254: DD3.33 25.25,10.91 arc45 25.54,10.21 26.21,9.54 arc-45 26.5,8.84 R6.2
N$54
  Top 0.254: DD3.44 29.34,16.75 arc45 30.04,17.04 30.21,17.21 arc45 30.5,17.91 30.5,18.59 arc-45 30.79,19.29 arc-45 31.29,19.5 C13.2
N$55
  Top 0.254: DD2.7 11.53,39.02 R15.1
N$56
  Top 0.254: R16.1 38.45,18.14 arc45 38.16,18.84 37,20 C15.2
N$57
  Top 0.254: R15.2 10.86,40.95 arc45 10.16,40.66 9,39.5 HL1.A2
N$58
  Top 0.254: R16.2 35.09,15.54 arc-45 34.39,15.25 30.54,15.25 arc-45 30.04,15.46 arc45 29.34,15.75 DD3.42
N$59
  Top 0.254: DD3.39 36.3,14.25 R21.1 R18.2
N$60
  Top 0.254: R18.1 38.45,12.35 39.16,13.06 arc45 39.45,13.76 39.45,14.79 arc-45 39.74,15.49 arc45 39.95,15.99 39.95,22.64 arc45 39.66,23.34 37,26 C18.2
N$61
  Top 0.254: DD3.46 28.5,17.75 arc90 29.5,18.75 29.5,21.54 arc-45 29.79,22.24 R19.2 R20.1
N$62
  Top 0.254: R19.1 33.95,25.1 36.66,27.81 arc45 36.95,28.51 C22.2
N$65
  Top 0.254: R22.1 10.41,43.5 arc-45 9.71,43.79 9,44.5 HL1.A1
N$66
  Top 0.254: DD2.6 12.18,36.78 arc-45 12.46,37.46 arc45 12.75,38.16 12.75,41.34 arc-45 13.04,42.04 13.21,42.21 arc45 13.5,42.91 13.5,43.45 R22.2
N$67
  Top 0.254: R14.2 17,38.95 17,38.25 15.72,36.97 arc45 15.43,36.26 DD2.1 15.4,35.8 15.4,35.1 arc-90 14.4,34.1 6.51,34.1 arc-45 5.81,34.39 5.64,34.56 arc45 4.94,34.85 3.11,34.85 arc45 2.41,34.56 2.35,34.5 SB1.2
RMIX
  Top 0.254: R1.1 53.15,12.05 52.29,11.19 arc-45 51.59,10.9 50.16,10.9 arc45 49.46,10.61 48.1,9.25 PCB1.ARMIX
  Bottom 0.254: PCB1.ARMIX' PCB1.ARMIX
SMBCLK  (via drill 0.5)
  Top 0.254: DD2.3 14.12,36.46 arc-45 14.42,37.17 15.21,37.96 arc45 15.5,38.66 15.5,45.84 arc-45 15.79,46.54 17.46,48.21 arc-45 18.16,48.5 54.59,48.5 arc-45 55.29,48.21 v57,46.5
  Bottom 0.254: v57,46.5 57,37.48 arc-45 56.71,36.78 PCB1.ASMBCLK' PCB1.ASMBCLK
SMBDAT  (via drill 0.5)
  Top 0.254: DD2.2 14.78,36.36 arc-45 15.07,37.07 15.71,37.71 arc45 16,38.41 16,45.59 arc-45 16.29,46.29 17.71,47.71 arc-45 18.41,48 51.34,48 arc-45 52.04,47.71 v53.25,46.5
  Bottom 0.254: v53.25,46.5 53.25,41.41 arc45 53.54,40.71 54.15,40.1 arc-45 54.45,39.39 PCB1.ASMBDAT' PCB1.ASMBDAT
USB_N
  Top 0.254: DD2.17 13.47,26 arc-90 12.47,25 12.15,25 VD1.2 11.55,25.5 arc45 11.19,25.65 XS1.2
USB_P
  Top 0.254: XS1.3 10.5,25 arc-90 11,24.5 11,23.5 arc90 11.5,23 12.05,23 VD1.1 12.15,23 12.59,23 arc45 13.29,23.29 13.83,23.83 arc45 14.12,24.54 DD2.18